# EAGLE design MCP4922 (EAGLE 6.5.0)
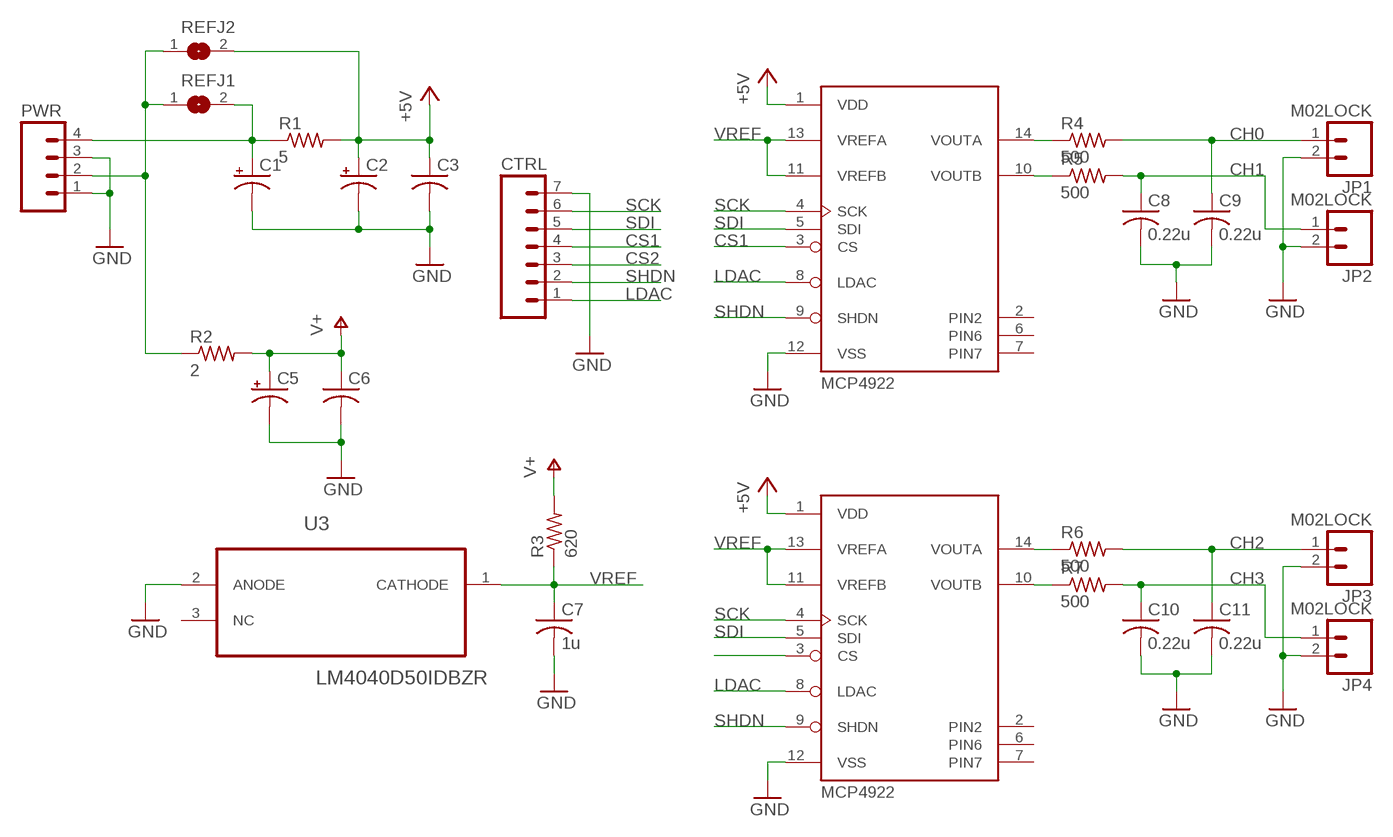
[diagram p0: schematic, sheet 1]

## Parts
C1  CPOL-US153CLV-0405  [153CLV-0405]
C2  CPOL-US153CLV-0505  [153CLV-0505]
C3  C-USC0805  [C0805]
C5  CPOL-US153CLV-0405  [153CLV-0405]
C6  C-USC0805  [C0805]
C7  1u  C-USC0805  [C0805]
C8  0.22u  C-USC0805  [C0805]
C9  0.22u  C-USC0805  [C0805]
C10  0.22u  C-USC0805  [C0805]
C11  0.22u  C-USC0805  [C0805]
CTRL  M07LOCK  [1X07_LOCK]
JP1  M02LOCK  [1X02_LOCK]
JP2  M02LOCK  [1X02_LOCK]
JP3  M02LOCK  [1X02_LOCK]
JP4  M02LOCK  [1X02_LOCK]
PWR  M04LOCK  [1X04_LOCK]
R1  5  R-US_R0805  [R0805]
R2  2  R-US_R0805  [R0805]
R3  620  R-US_R0805  [R0805]
R4  500  R-US_R0805  [R0805]
R5  500  R-US_R0805  [R0805]
R6  500  R-US_R0805  [R0805]
R7  500  R-US_R0805  [R0805]
REFJ1  SJ  [SJ]
REFJ2  SJ  [SJ]
U1  MCP4922  [SO-14]
U2  MCP4922  [SO-14]
U3  LM4040D50IDBZR  [SOT95P237X112-3N]

## Nets
+5V: C2.+ C3.1 R1.2 REFJ2.2 U1.1(VDD) U2.1(VDD)
CH0: C9.1 JP1.1 R4.2
CH1: C8.1 JP2.1 R5.2
CH2: C11.1 JP3.1 R6.2
CH3: C10.1 JP4.1 R7.2
CS1: CTRL.4 U1.3(CS)
CS2: CTRL.3 U2.3(CS)
GND: C1.- C2.- C3.2 C5.- C6.2 C7.2 C8.2 C9.2 C10.2 C11.2 CTRL.7 JP1.2 JP2.2 JP3.2 JP4.2 PWR.1 PWR.3 U1.12(VSS) U2.12(VSS) U3.2(ANODE)
LDAC: CTRL.1 U1.8(LDAC) U2.8(LDAC)
N$1: R7.1 U2.10(VOUTB)
N$2: R6.1 U2.14(VOUTA)
N$3: R5.1 U1.10(VOUTB)
N$4: R4.1 U1.14(VOUTA)
N$9: C1.+ PWR.4 R1.1 REFJ1.2
N$10: PWR.2 R2.1 REFJ1.1 REFJ2.1
SCK: CTRL.6 U1.4(SCK) U2.4(SCK)
SDI: CTRL.5 U1.5(SDI) U2.5(SDI)
SHDN: CTRL.2 U1.9(SHDN) U2.9(SHDN)
V+: C5.+ C6.1 R2.2 R3.2
VREF: C7.1 R3.1 U1.11(VREFB) U1.13(VREFA) U2.11(VREFB) U2.13(VREFA) U3.1(CATHODE)
Unconnected: U1.2(PIN2) U1.6(PIN6) U1.7(PIN7) U2.2(PIN2) U2.6(PIN6) U2.7(PIN7) U3.3(NC)

## Library data of the parts
C1 C2 C5 = rcl:CPOL-US: POLARIZED CAPACITOR, American symbol
C3 C6-C11 = rcl:C-US: CAPACITOR, American symbol
CTRL = SparkFun-Connectors:M07: Header 7 Standard 7-pin 0.1" header. Use with straight break away headers (SKU : PRT-00116), right angle break away headers (PRT-00553), swiss pins (PRT-00743), machine pins (PRT-00117), and female headers (PRT-00115). NOTES ON THE VARIANTS LOCK and LOCK_LONGPADS... This footprint was designed to help hold the alignment of a through-hole component (i.e. 7-pin header) while soldering it into place. You may notice that each hole has been shifted either up or down by 0.005 of an inch from it's more standard position (which is usually a perfectly straight line). This slight alteration caused the pins (the squares in the middle) to touch the edges of the holes. Because they are alternating, it causes a "brace" to hold the header in place. 0.005 has proven to be the perfect amount of "off-center" position when using our standard breakaway headers. Although looks a little odd when you look at the bare footprint, once you have a header in there, the alteration is very hard to notice. Also, if you push a header all the way into place, it is covered up entirely on the bottom side. This idea of altering the position of holes to aid alignment will be further integrated into the Sparkfun Library for other footprints. It can help hold any component with 3 or more connection pins.
JP1-JP4 = SparkFun-Connectors:M02: Standard 2-pin 0.1" header. Use with - straight break away headers ( PRT-00116) - right angle break away headers (PRT-00553) - swiss pins (PRT-00743) - machine pins (PRT-00117) - female headers (PRT-00115) Molex polarized connector foot print use with: PRT-08233 with associated crimp pins and housings. 2.54_SCREWTERM for use with PRT-10571. 3.5mm Screw Terminal footprints for PRT-08084 5mm Screw Terminal footprints for use with PRT-08432
PWR = SparkFun-Connectors:M04: Header 4 Standard 4-pin 0.1" header. Use with straight break away headers (SKU : PRT-00116), right angle break away headers (PRT-00553), swiss pins (PRT-00743), machine pins (PRT-00117), and female headers (PRT-00115). Molex polarized connector foot print use with SKU : PRT-08231 with associated crimp pins and housings. 1MM SMD Version SKU: PRT-10208
R1-R7 = rcl:R-US_: RESISTOR, American symbol
REFJ1 REFJ2 = jumper:SJ: SMD solder JUMPER
U1 U2 = microchip:MCP4922
U3 = LM4040-5.0_SOIC:LM4040D50IDBZR: PRECISION MICROPOWER SHUNT VOLTAGE REFERENCE; MPN: LM4040D50IDBZR; OC_FARNELL: 1652239; OC_NEWARK: 43K3367; PACKAGE: 3-SOT-23; SUPPLIER: TEXAS INSTRUMENTS

## Board
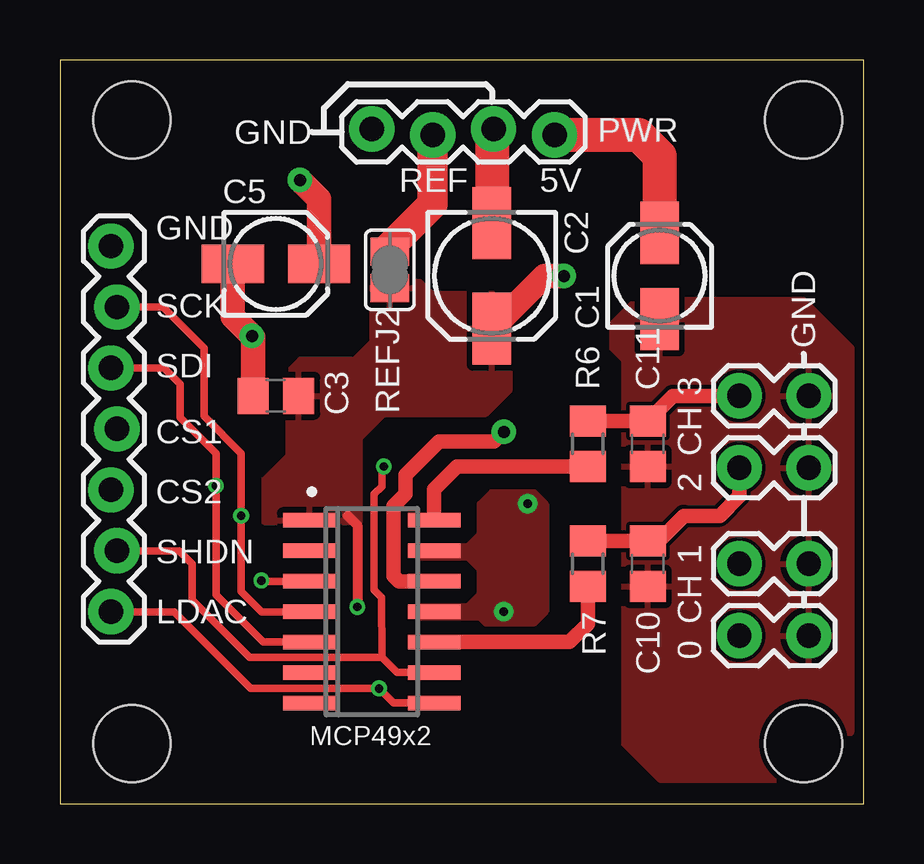
[diagram p1: board, top side]
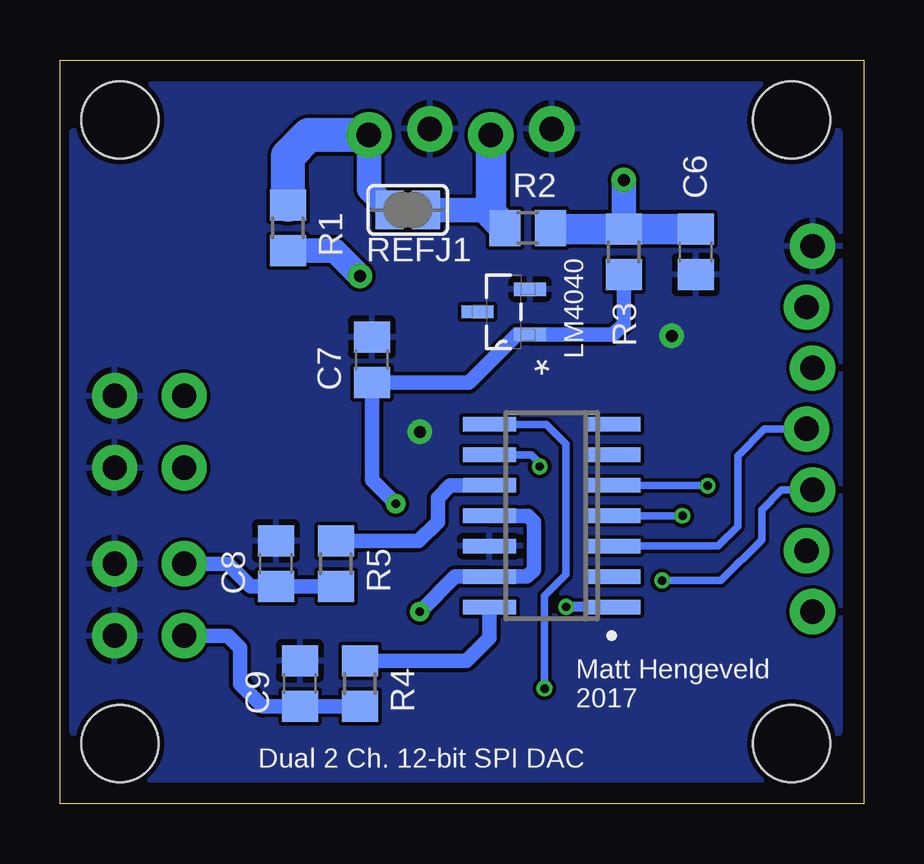
[diagram p2: board, bottom side, seen from below]

Size 33.5 x 31 mm. Coordinates in mm from the lower left corner, seen from the top.
Outline: 0,0 33.5,0 33.5,31 0,31 0,0
Copper layers (1*16): Top 0.035mm / dielectric 1.5mm / Bottom 0.035mm
Design rules "SeeedStudio_2layer_DRU_no_angle_20140221": minimum track width 6mil, minimum drill 12mil, track to track 6mil, track to pad 6mil, pad to pad 6mil, via to via 6mil, smd to smd 0mil, copper to edge 10mil, drill to drill 10mil, minimum pad ring 10mil, minimum via ring 6mil, stop-mask expansion 2mil, vias tented up to drill 100mil, thermal gap 10mil
Holes 3.2 mm at 3,2.5 31,28.5 3,28.5 31,2.5

### Footprints (pad centres in the part's own frame; a part is rotated, then mirrored left to right if it is on the bottom)
153CLV-0405 = smd 2.6 x 1.6: + 1.8,0; - -1.8,0
153CLV-0505 = smd 3 x 1.6: + 2.2,0; - -2.2,0
C0805 = smd 1.3 x 1.5: 1 -0.95,0; 2 0.95,0
1X07_LOCK = drill 1.016 pad 1.88: 1 0,0.127; 2 2.54,-0.127; 3 5.08,0.127; 4 7.62,-0.127; 5 10.16,0.127; 6 12.7,-0.127; 7 15.24,0.127
1X02_LOCK = drill 1.016 pad 1.88: 1 -0.178,0; 2 2.718,0
1X04_LOCK = drill 1.016 pad 1.88: 1 0,0.127; 2 2.54,-0.127; 3 5.08,0.127; 4 7.62,-0.127
R0805 = smd 1.3 x 1.5: 1 -0.95,0; 2 0.95,0
SJ = smd 1.168 x 1.6: 1 -0.762,0; 2 0.762,0
SO-14 = smd 0.6 x 2.2: 1 -3.81,-2.6; 2 -2.54,-2.6; 3 -1.27,-2.6; 4 0,-2.6; 5 1.27,-2.6; 6 2.54,-2.6; 7 3.81,-2.6; 8 3.81,2.6; 9 2.54,2.6; 10 1.27,2.6; 11 0,2.6; 12 -1.27,2.6; 13 -2.54,2.6; 14 -3.81,2.6
SOT95P237X112-3N = smd 1.321 x 0.559: 1 -1.092,0.94; 2 -1.092,-0.94 | smd 1.321 x 0.508: 3 1.092,0

### Placement (x,y rotation side)
C1  25,22 90 top
C2  18,22 270 top
C3  9,17 180 top
C5  9,22.5 0 top
C6  7,23 270 bottom
C7  20.5,18.5 90 bottom
C8  24.5,10 90 bottom
C9  23.5,5 90 bottom
C10  24.5,10 270 top
C11  24.5,15 270 top
CTRL  2.25,8 90 top
JP1  28.5,7 0 top
JP2  28.5,10 0 top
JP3  28.5,17 0 top
JP4  28.5,14 0 top
PWR  13,28 0 top
R1  24,24 270 bottom
R2  14,24 0 bottom
R3  10,23 90 bottom
R4  21,5 270 bottom
R5  22,10 270 bottom
R6  22,15 90 top
R7  22,10 90 top
REFJ1  19,24.75 180 bottom
REFJ2  13.75,22.25 270 top
U1  13,12 90 bottom
U2  13,8 270 top
U3  15,20.5 180 bottom

### Tracks (layer width: path | path; a pad name or v marks a point on that pad's centre or on a via)
+5V  (via drill 0.35 pad 0.61, 0.5 pad 1.02)
  Top 0.406: v12.4,8.2 12.4,11.6 12,12
  Top 1.016: C2.+ 20.2,22 v21,22
  Bottom 0.406: U1.1 v12.39,8.19 v12.4,8.2
  Bottom 1.016: R1.2 22.05,23.05 v21,22
  pour Top: 18.75,17.25 18.75,21.25 15.5,21.25 15,21.75 13,21.75 13,19.25 12.25,18.5 10,18.5 9.5,18 9.5,14.5 8.5,13.5 8.5,11.75 12.5,11.75 12.5,15.25 13.5,16.25 17.75,16.25
CH0
  Bottom 0.61: R4.2 C9.1 25.05,4.05 26,5 26,6.5 26.5,7 JP1.1
CH1
  Bottom 0.61: R5.2 C8.1 25.55,9.05 26.5,10 JP2.1
CH2
  Top 0.61: R6.2 C11.1 | 24.55,16 C11.1 | JP3.1 25.55,17 C11.1
CH3
  Top 0.61: R7.2 C10.1 24.55,11 25,11 26,12 27.5,12 28.32,12.82 JP4.1
CS1
  Bottom 0.305: U1.3 6.07,10.73 5.25,11.55 5.25,14.5 4.13,15.62 CTRL.4
CS2  (via drill 0.35 pad 0.61)
  Top 0.305: U2.3 8.43,9.27 v8.4,9.3
  Bottom 0.305: v8.4,9.3 5.95,9.3 4.25,11 4.25,12.25 3.42,13.08 CTRL.3
GND  (via drill 0.5 pad 1.02)
  Top 0.61: U2.12 14.13,9.27 13.9,9.5 13.9,12.4 14.4,12.9 14.4,13.7 15.8,15.1 18.1,15.1 v18.5,15.5
  Top 1.016: C3.2 8.05,19.45 v8,19.5 7.2,20.3 C5.-
  Top 1.422: PWR.3 18,28.05 C2.-
  pour Bottom: 31,30 3,30 1,28 1,3 3,1 31,1 33,3 33,28
  pour Top: 31,1 33,3 33,19 31,21 24,21 23,20 23,19 23.5,18.5 23.5,2.5 25,1
LDAC  (via drill 0.35 pad 0.61)
  Top 0.305: U2.8 13.91,4.19 v13.3,4.8 7.95,4.8 4.75,8 CTRL.1
  Bottom 0.305: v13.3,4.8 13.3,8.65 12.4,9.55 12.4,15 13.21,15.81 U1.8
N$1
  Top 0.61: R7.1 22,7.5 21.23,6.73 U2.10
N$2
  Top 0.61: R6.1 16.55,14.05 15.6,13.1 U2.14
N$3
  Bottom 0.61: U1.10 17.23,13.27 17.75,12.75 17.75,11.75 18.55,10.95 R5.1
N$4
  Bottom 0.61: R4.1 16.55,5.95 15.6,6.9 U1.14
N$9
  Top 1.422: C1.+ 25,27 24.13,27.87 PWR.4
  Bottom 1.016: PWR.4 20.62,25.61 REFJ1.2
  Bottom 1.422: R1.1 24,27 23.13,27.87 PWR.4
N$10
  Top 1.27: REFJ2.1 13.75,23.21 15.54,25 PWR.2
  Bottom 1.016: REFJ1.1 15.79,24.75 15.54,25
  Bottom 1.27: PWR.2 15.54,25 15.54,24.59 R2.1
SCK  (via drill 0.35 pad 0.61)
  Top 0.305: U2.4 8.4,8 7.55,8.85 v7.55,12 7.55,14.6 6,16.15 6,19 4.3,20.7 CTRL.6
  Bottom 0.305: U1.4 v7.55,12
SDI  (via drill 0.35 pad 0.61)
  Top 0.305: U2.5 8.47,6.73 6.5,8.7 v6.5,13.25 6.5,14.6 5,16.1 5,17.5 4.34,18.16 CTRL.5
  Bottom 0.305: U1.5 6.52,13.27 v6.5,13.25
SHDN  (via drill 0.35 pad 0.61)
  Top 0.305: U2.9 14.06,5.46 13.42,6.1 | 13.42,6.1 7.9,6.1 5.5,8.5 5.5,10 4.96,10.54 CTRL.2 | 13.42,6.1 13.4,8.6 13.1,8.9 13.1,12.9 13.42,13.22 13.42,13.97 v13.5,14.05
  Bottom 0.305: U1.9 13.84,14.54 13.5,14.2 v13.5,14.05
V+  (via drill 0.5 pad 1.02)
  Top 1.016: C5.+ 10.8,25.2 v10,26
  Bottom 1.016: R3.2 v10,26
  Bottom 1.27: R2.2 13,23.95 R3.2 C6.1
VREF  (via drill 0.35 pad 0.81)
  Bottom 0.61: R3.1 10,20 10.44,19.56 U3.1 14.44,19.56 16.45,17.55 C7.1 20.5,13.5 v19.5,12.5 | v18.5,8 17.04,9.46 U1.13 14.04,9.46 13.75,9.75 13.75,11.75 14,12 U1.11
  pour Top (isolate 0.305, no thermals): 19.75,13 20.25,12.5 20.25,8 19.75,7.5 17.75,7.5 17.5,7.75 15,7.75 15,8.25 17,8.25 17.5,8.75 17.5,9.75 17,10.25 15,10.25 15,10.75 17,10.75 17.5,11.25 17.5,12.5 18,13

### Text on the board
tPlace: GND | REF | 5V | GND | SCK | GND | SDI | 3 | CS1 | CH | 2 | CS2 | SHDN | 1 | LDAC | CH | 0 | MCP49x2
bPlace: LM4040 | Matt Hengeveld / 2017 | Dual 2 Ch. 12-bit SPI DAC